# Altium schematic sheet Primary_Cabinet.SchDoc: <Document>
size Letter; Engineer: <Engineer>; Organization: UPEL; Address1: USU Power Electronics Lab; Address2: USTAR Building 620, RM 118; Address3: 1600 N 620 E; Address4: North Logan, UT 84341; DocumentNumber: 5; Revision: v1; SheetNumber: 5; SheetTotal: 16; ProjectName: <Project>
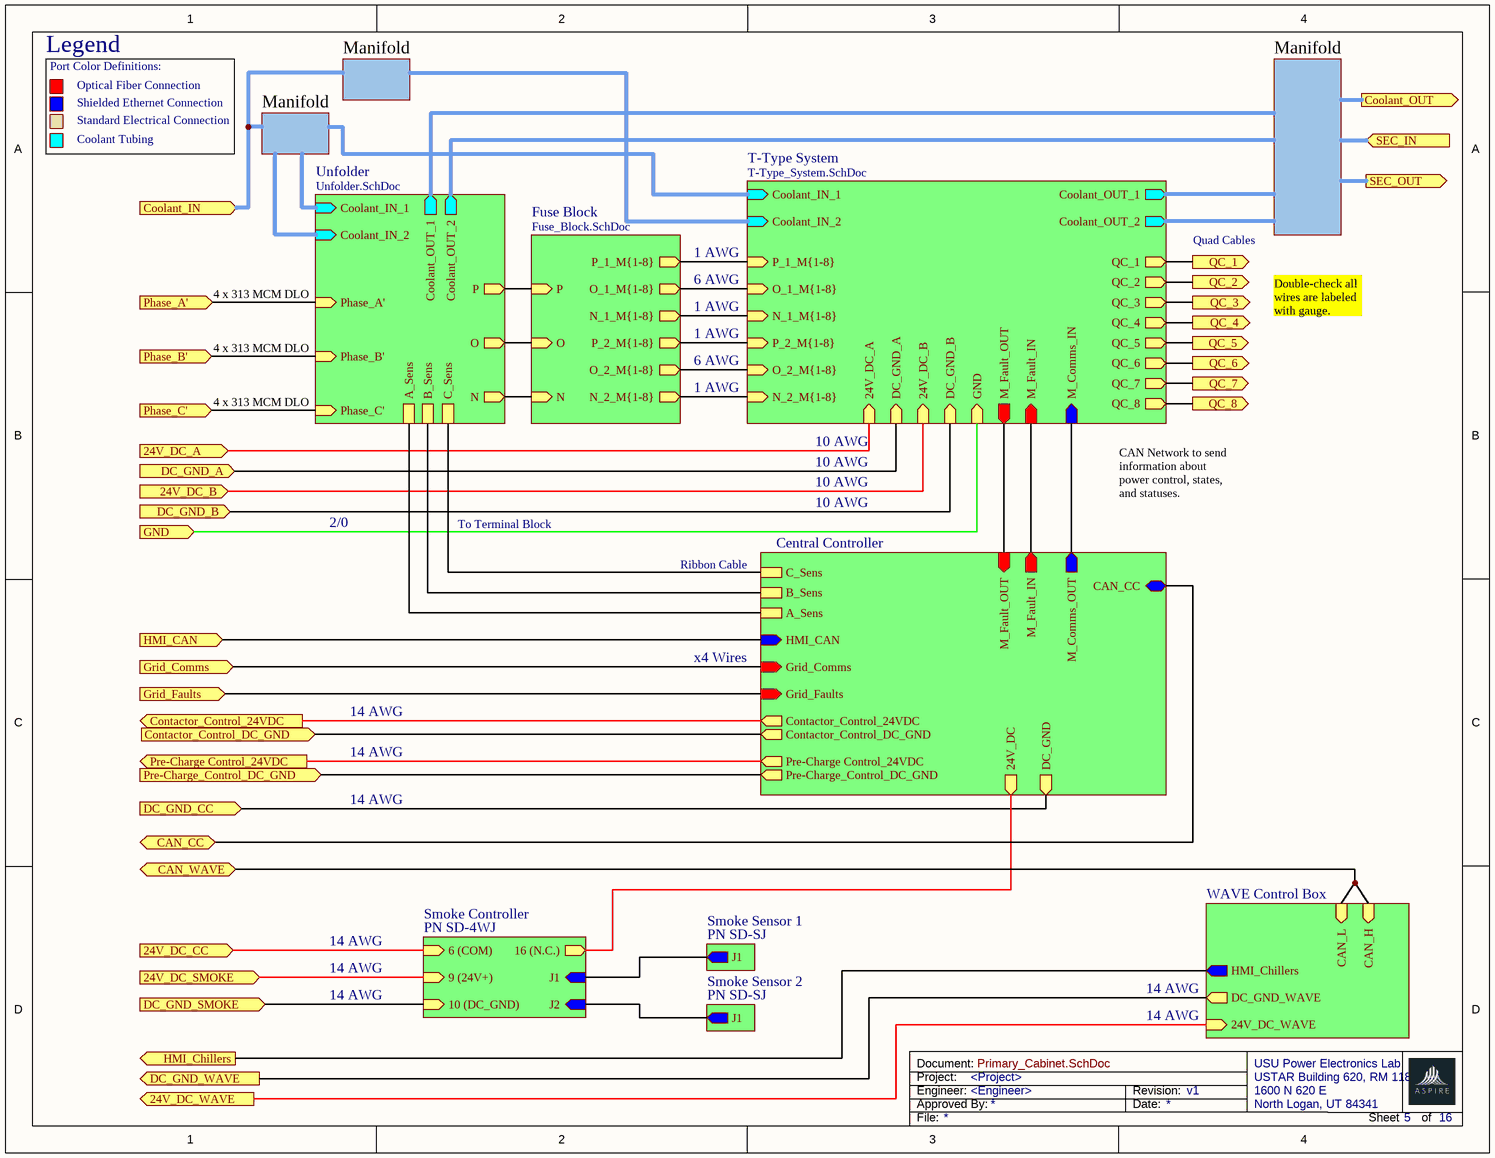
[diagram p0: Primary_Cabinet.SchDoc]

## Sub-sheets
Central Controller = File Name: HMI_CAN (in), Grid_Comms (in), Grid_Faults (in), 24V_DC (out), Contactor_Control_24VDC (out), Contactor_Control_DC_GND (out), M_Fault_OUT (in), M_Fault_IN (out), M_Comms_OUT (out), DC_GND (out), Pre-Charge_Control_DC_GND (out), Pre-Charge Control_24VDC (out), CAN_CC (bidir), C_Sens, B_Sens, A_Sens
Fuse Block = Fuse_Block.SchDoc: P (in), O (in), N (in), N_2_M{1-8} (out), O_2_M{1-8} (out), P_2_M{1-8} (out), N_1_M{1-8} (out), O_1_M{1-8} (out), P_1_M{1-8} (out)
Smoke Controller = PN SD-4WJ: 10 (DC_GND) (in), 9 (24V+) (in), 16 (N.C.) (out), 6 (COM) (in), J1 (in), J2 (in)
Smoke Sensor 1 = PN SD-SJ: J1 (out)
Smoke Sensor 2 = PN SD-SJ: J1 (out)
T-Type System = T-Type_System.SchDoc: Coolant_IN_1 (in), Coolant_OUT_1 (out), QC_2 (out), QC_1 (out), QC_3 (out), QC_6 (out), QC_7 (out), QC_8 (out), QC_5 (out), QC_4 (out), N_2_M{1-8} (in), O_2_M{1-8} (in), P_2_M{1-8} (in), N_1_M{1-8} (in), O_1_M{1-8} (in), P_1_M{1-8} (in), M_Fault_OUT (out), M_Comms_IN (in), M_Fault_IN (in), 24V_DC_B (in), 24V_DC_A (in), DC_GND_A (in), DC_GND_B (in), Coolant_IN_2 (in), Coolant_OUT_2 (out), GND (in)
Unfolder = Unfolder.SchDoc: Phase_B' (in), Phase_A' (in), N (out), P (out), O (out), Phase_C' (in), Coolant_IN_2 (in), Coolant_OUT_2 (out), Coolant_IN_1 (in), Coolant_OUT_1 (out), C_Sens, B_Sens, A_Sens
WAVE Control Box = box.SchDoc: 24V_DC_WAVE (in), DC_GND_WAVE (out), HMI_Chillers (out), CAN_L (in), CAN_H (in)

## Ports
24V_DC_A (in), 24V_DC_B (in), 24V_DC_CC (in), 24V_DC_SMOKE (in), 24V_DC_WAVE (out), CAN_CC (bidir), CAN_WAVE (bidir), Contactor_Control_24VDC (out), Contactor_Control_DC_GND (in), Coolant_IN (in), Coolant_OUT (out), DC_GND_A (in), DC_GND_B (in), DC_GND_CC (in), DC_GND_SMOKE (in), DC_GND_WAVE (out), GND (in), Grid_Comms (in), Grid_Faults (in), HMI_CAN (in), HMI_Chillers (out), Phase_A' (in), Phase_B' (in), Phase_C' (in), Pre-Charge Control_24VDC (out), Pre-Charge_Control_DC_GND (in), QC_1 (out), QC_2 (out), QC_3 (out), QC_4 (out), QC_5 (out), QC_6 (out), QC_7 (out), QC_8 (out), SEC_IN (in), SEC_OUT (out)

## Nets
24V_DC_A: port 24V_DC_A, sheet T-Type System/24V_DC_A
24V_DC_B: port 24V_DC_B, sheet T-Type System/24V_DC_B
24V_DC_CC: port 24V_DC_CC, sheet Smoke Controller/6 (COM)
24V_DC_SMOKE: port 24V_DC_SMOKE, sheet Smoke Controller/9 (24V+)
24V_DC_WAVE: port 24V_DC_WAVE, sheet WAVE Control Box/24V_DC_WAVE
CAN_CC: port CAN_CC, sheet Central Controller/CAN_CC
CAN_WAVE: port CAN_WAVE, sheet WAVE Control Box/CAN_L, sheet WAVE Control Box/CAN_H
Contactor_Control_24VDC: port Contactor_Control_24VDC, sheet Central Controller/Contactor_Control_24VDC
Contactor_Control_DC_GND: port Contactor_Control_DC_GND, sheet Central Controller/Contactor_Control_DC_GND
DC_GND_A: port DC_GND_A, sheet T-Type System/DC_GND_A
DC_GND_B: port DC_GND_B, sheet T-Type System/DC_GND_B
DC_GND_CC: port DC_GND_CC, sheet Central Controller/DC_GND
DC_GND_SMOKE: port DC_GND_SMOKE, sheet Smoke Controller/10 (DC_GND)
DC_GND_WAVE: port DC_GND_WAVE, sheet WAVE Control Box/DC_GND_WAVE
GND: port GND, sheet T-Type System/GND
Grid_Comms: port Grid_Comms, sheet Central Controller/Grid_Comms
Grid_Faults: port Grid_Faults, sheet Central Controller/Grid_Faults
HMI_CAN: port HMI_CAN, sheet Central Controller/HMI_CAN
HMI_Chillers: port HMI_Chillers, sheet WAVE Control Box/HMI_Chillers
Phase_A': port Phase_A', sheet Unfolder/Phase_A'
Phase_B': port Phase_B', sheet Unfolder/Phase_B'
Phase_C': port Phase_C', sheet Unfolder/Phase_C'
Pre-Charge Control_24VDC: port Pre-Charge Control_24VDC, sheet Central Controller/Pre-Charge Control_24VDC
Pre-Charge_Control_DC_GND: port Pre-Charge_Control_DC_GND, sheet Central Controller/Pre-Charge_Control_DC_GND
QC_1: port QC_1, sheet T-Type System/QC_1
QC_2: port QC_2, sheet T-Type System/QC_2
QC_3: port QC_3, sheet T-Type System/QC_3
QC_4: port QC_4, sheet T-Type System/QC_4
QC_5: port QC_5, sheet T-Type System/QC_5
QC_6: port QC_6, sheet T-Type System/QC_6
QC_7: port QC_7, sheet T-Type System/QC_7
QC_8: port QC_8, sheet T-Type System/QC_8
(unnamed): sheet Central Controller/24V_DC, sheet Smoke Controller/16 (N.C.)
(unnamed): sheet Central Controller/M_Fault_OUT, sheet T-Type System/M_Fault_OUT
(unnamed): sheet Central Controller/M_Fault_IN, sheet T-Type System/M_Fault_IN
(unnamed): sheet Central Controller/M_Comms_OUT, sheet T-Type System/M_Comms_IN
(unnamed): sheet Central Controller/C_Sens, sheet Unfolder/C_Sens
(unnamed): sheet Central Controller/B_Sens, sheet Unfolder/B_Sens
(unnamed): sheet Central Controller/A_Sens, sheet Unfolder/A_Sens
(unnamed): sheet Fuse Block/P, sheet Unfolder/P
(unnamed): sheet Fuse Block/O, sheet Unfolder/O
(unnamed): sheet Fuse Block/N, sheet Unfolder/N
(unnamed): sheet Fuse Block/N_2_M{1-8}, sheet T-Type System/N_2_M{1-8}
(unnamed): sheet Fuse Block/O_2_M{1-8}, sheet T-Type System/O_2_M{1-8}
(unnamed): sheet Fuse Block/P_2_M{1-8}, sheet T-Type System/P_2_M{1-8}
(unnamed): sheet Fuse Block/N_1_M{1-8}, sheet T-Type System/N_1_M{1-8}
(unnamed): sheet Fuse Block/O_1_M{1-8}, sheet T-Type System/O_1_M{1-8}
(unnamed): sheet Fuse Block/P_1_M{1-8}, sheet T-Type System/P_1_M{1-8}
(unnamed): sheet Smoke Controller/J1, sheet Smoke Sensor 1/J1
(unnamed): sheet Smoke Controller/J2, sheet Smoke Sensor 2/J1

## Notes on the sheet
- Legend
- Port Color Definitions:
- Optical Fiber Connection
- Manifold
- Shielded Ethernet Connection
- Standard Electrical Connection
- Coolant Tubing
- 4 x 313 MCM DLO
- 1 AWG
- 6 AWG
- Quad Cables
- Double-check all wires are labeled with gauge.
- 10 AWG
- CAN Network to send information about power control, states, and statuses.
- 2/0
- To Terminal Block
- Ribbon Cable
- x4 Wires
- 14 AWG
- Project:
- Engineer:
- Document:
- Approved By:
- Date:
- Revision:
- File:
- Sheet
- of